# EAGLE design PIPduino (EAGLE 7.1.0)
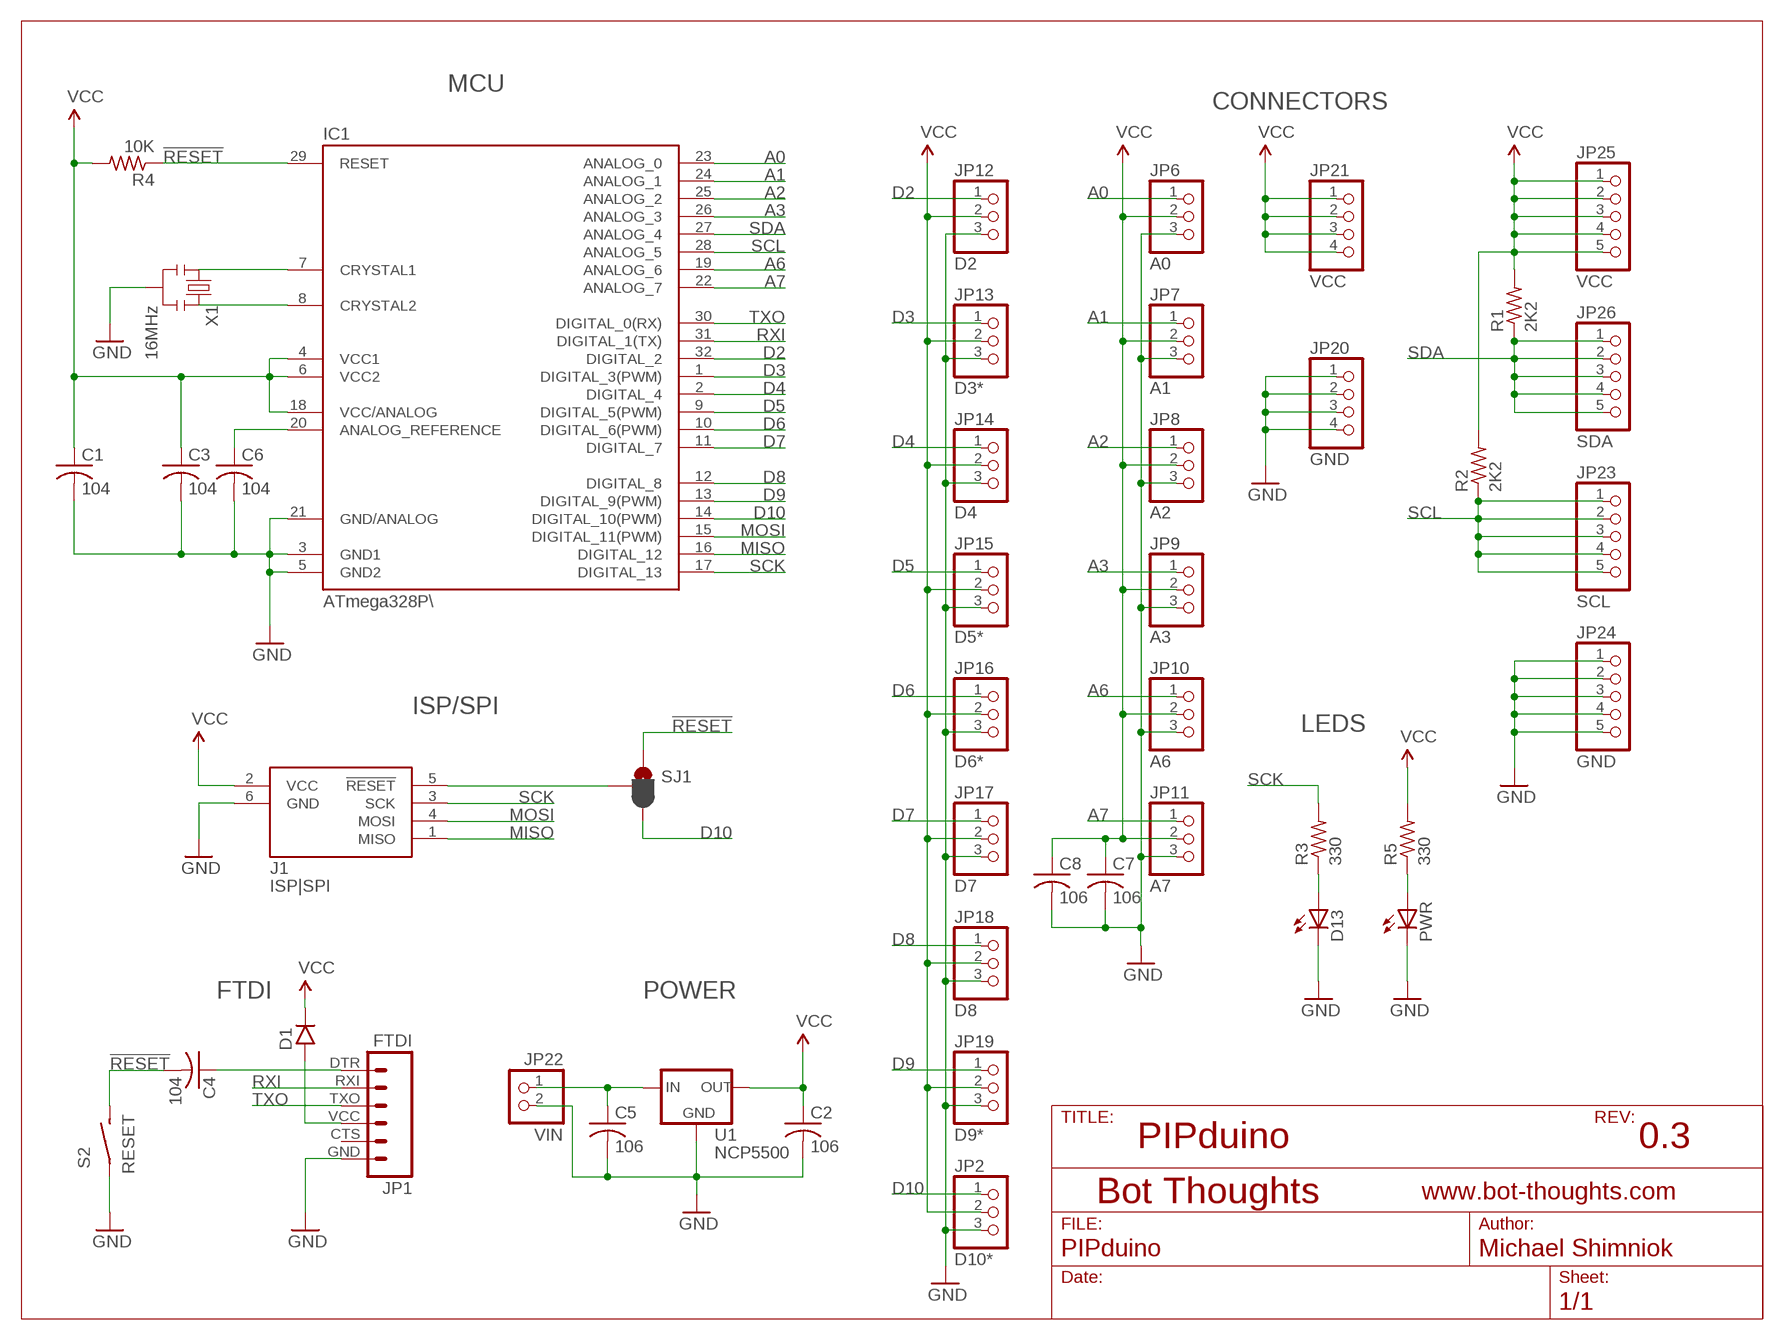
[diagram p0: schematic, sheet 1]

## Parts
C1  104  C-USC0603  [C0603]
C2  106  C-USC1206  [C1206]
C3  104  C-USC0603  [C0603]
C4  104  C-USC0603  [C0603]
C5  106  C-USC1206  [C1206]
C6  104  C-USC0603  [C0603]
C7  106  C-USC1206  [C1206]
C8  106  C-USC1206  [C1206]
D1  DIODE_SOD123FL  [SOD123FL]
D13  LED3MM  [LED3MM]
IC1  ATmega328P\  ATMEGA168-AU  [TQFP32-08]
J1  ISP|SPI  AVRISP6_COMPACT  [CON6P2R]
JP1  FTDI  FTDI_BASICPTH  [FTDI_BASIC]
JP2  D10*  PINHD-1X03_2.54-S  [1X03-S]
JP6  A0  PINHD-1X03_2.54-S  [1X03-S]
JP7  A1  PINHD-1X03_2.54-S  [1X03-S]
JP8  A2  PINHD-1X03_2.54-S  [1X03-S]
JP9  A3  PINHD-1X03_2.54-S  [1X03-S]
JP10  A6  PINHD-1X03_2.54-S  [1X03-S]
JP11  A7  PINHD-1X03_2.54-S  [1X03-S]
JP12  D2  PINHD-1X03_2.54-S  [1X03-S]
JP13  D3*  PINHD-1X03_2.54-S  [1X03-S]
JP14  D4  PINHD-1X03_2.54-S  [1X03-S]
JP15  D5*  PINHD-1X03_2.54-S  [1X03-S]
JP16  D6*  PINHD-1X03_2.54-S  [1X03-S]
JP17  D7  PINHD-1X03_2.54-S  [1X03-S]
JP18  D8  PINHD-1X03_2.54-S  [1X03-S]
JP19  D9*  PINHD-1X03_2.54-S  [1X03-S]
JP20  GND  PINHD-1X04_2.54-S  [1X04-S]
JP21  VCC  PINHD-1X04_2.54-S  [1X04-S]
JP22  VIN  PINHD-1X02_2.54-S  [1X02-S]
JP23  SCL  PINHD-1X05_2.54-S  [1X05-S]
JP24  GND  PINHD-1X05_2.54-S  [1X05-S]
JP25  VCC  PINHD-1X05_2.54-S  [1X05-S]
JP26  SDA  PINHD-1X05_2.54-S  [1X05-S]
PWR  LED3MM  [LED3MM]
R1  2K2  R-US_R0603  [R0603]
R2  2K2  R-US_R0603  [R0603]
R3  330  R-US_R0603  [R0603]
R4  10K  R-US_R0603  [R0603]
R5  330  R-US_R0603  [R0603]
S2  RESET  SPST_3X4X2  [3X4X2TACT]
SJ1  JUMPER-PAD-3-2OF3_NC_BY_PASTE  [PAD-JUMPER-3-2OF3_NC_BY_PASTE_YES_SILK_FULL_BOX]
U1  NCP5500  [DPAK]
X1  16MHz  RESONATOR_CSTCE_V_C  [CSTCE_V_C]

## Nets
!RESET: C4.2 IC1.29(RESET) R4.1 S2.P$2(S) SJ1.1
A0: IC1.23(ANALOG_0) JP6.1
A1: IC1.24(ANALOG_1) JP7.1
A2: IC1.25(ANALOG_2) JP8.1
A3: IC1.26(ANALOG_3) JP9.1
A6: IC1.19(ANALOG_6) JP10.1
A7: IC1.22(ANALOG_7) JP11.1
D2: IC1.32(DIGITAL_2) JP12.1
D3: IC1.1(DIGITAL_3(PWM)) JP13.1
D4: IC1.2(DIGITAL_4) JP14.1
D5: IC1.9(DIGITAL_5(PWM)) JP15.1
D6: IC1.10(DIGITAL_6(PWM)) JP16.1
D7: IC1.11(DIGITAL_7) JP17.1
D8: IC1.12(DIGITAL_8) JP18.1
D9: IC1.13(DIGITAL_9(PWM)) JP19.1
D10: IC1.14(DIGITAL_10(PWM)) JP2.1 SJ1.3
GND: C1.2 C2.2 C3.2 C5.2 C6.2 C7.2 C8.2 D13.K(C) IC1.3(GND1) IC1.5(GND2) IC1.21(GND/ANALOG) J1.6(GND) JP1.GND JP2.3 JP6.3 JP7.3 JP8.3 JP9.3 JP10.3 JP11.3 JP12.3 JP13.3 JP14.3 JP15.3 JP16.3 JP17.3 JP18.3 JP19.3 JP20.1 JP20.2 JP20.3 JP20.4 JP22.2 JP24.1 JP24.2 JP24.3 JP24.4 JP24.5 PWR.K(C) S2.P$1(P) U1.4(GND) X1.GND
MISO: IC1.16(DIGITAL_12) J1.1(MISO)
MOSI: IC1.15(DIGITAL_11(PWM)) J1.4(MOSI)
N$1: D13.A R3.1
N$2: C5.1 JP22.1 U1.1(VIN)
N$3: J1.5(!RESET) SJ1.2
N$4: PWR.A R5.1
N$5: D1.A JP1.VCC
N$6: C6.1 IC1.20(ANALOG_REFERENCE)
N$8: IC1.7(CRYSTAL1) X1.X1
N$13: IC1.8(CRYSTAL2) X1.X2
N$15: C4.1 JP1.DTR
RXI: IC1.31(DIGITAL_1(TX)) JP1.RXI
SCK: IC1.17(DIGITAL_13) J1.3(SCK) R3.2
SCL: IC1.28(ANALOG_5) JP23.1 JP23.2 JP23.3 JP23.4 JP23.5 R2.1
SDA: IC1.27(ANALOG_4) JP26.1 JP26.2 JP26.3 JP26.4 JP26.5 R1.1
TXO: IC1.30(DIGITAL_0(RX)) JP1.TXO
VCC: C1.1 C2.1 C3.1 C7.1 C8.1 D1.C IC1.4(VCC1) IC1.6(VCC2) IC1.18(VCC/ANALOG) J1.2(VCC) JP2.2 JP6.2 JP7.2 JP8.2 JP9.2 JP10.2 JP11.2 JP12.2 JP13.2 JP14.2 JP15.2 JP16.2 JP17.2 JP18.2 JP19.2 JP21.1 JP21.2 JP21.3 JP21.4 JP25.1 JP25.2 JP25.3 JP25.4 JP25.5 R1.2 R2.2 R4.2 R5.2 U1.3(VOUT)
Unconnected: JP1.CTS

## Notes on the sheet
- MCU
- CONNECTORS
- ISP/SPI
- LEDS
- FTDI | POWER
- PIPduino | 0.3

## Library data of the parts
C1-C8 = rcl:C-US: CAPACITOR, American symbol
D1 = bt_diode:DIODE: Diode Collection of generic diodes in various packages
D13 PWR = bt_opto:LED: LED Various packages
IC1 = Arduino-AVR:ATMEGA168
J1 = bt_avr:AVRISP6: 6-pin dual-row connector for Atmel AVRISP programmer interface
JP1 = SparkFun:FTDI_BASIC: FTDI Basic: 3.3V and 5V
JP2 JP6-JP19 = pinhead-2:PINHD-1X03: PIN HEADER
JP20 JP21 = pinhead-2:PINHD-1X04: PIN HEADER
JP22 = pinhead-2:PINHD-1X02: PIN HEADER
JP23-JP26 = pinhead-2:PINHD-1X05: PIN HEADER
R1-R5 = rcl:R-US_: RESISTOR, American symbol
S2 = bt_electromech:SPST: SPST SWITCH
SJ1 = SparkFun-Passives:JUMPER-PAD-3-2OF3_NC_BY_PASTE
U1 = bt_regulator:NCP5500: NCP5500, NCV5500, NCP5501, NCV5501 LDO Voltage Regulator These linear low drop voltage regulators provide up to 500 mA over a user−adjustable output range of 1.25 V to 5.0 V, or at a fixed output voltage of 1.5 V, 3.3 V or 5.0 V, with typical output voltage accuracy better than 3%. Reverse bias protection, thermal shutdown, and short circuit protection. Dropout is 230 mV at 500 mA
X1 = bt_crystal:RESONATOR: Crystal Resonator, 3-pin

## Net classes
1 power: width 0.254 mm

## Board
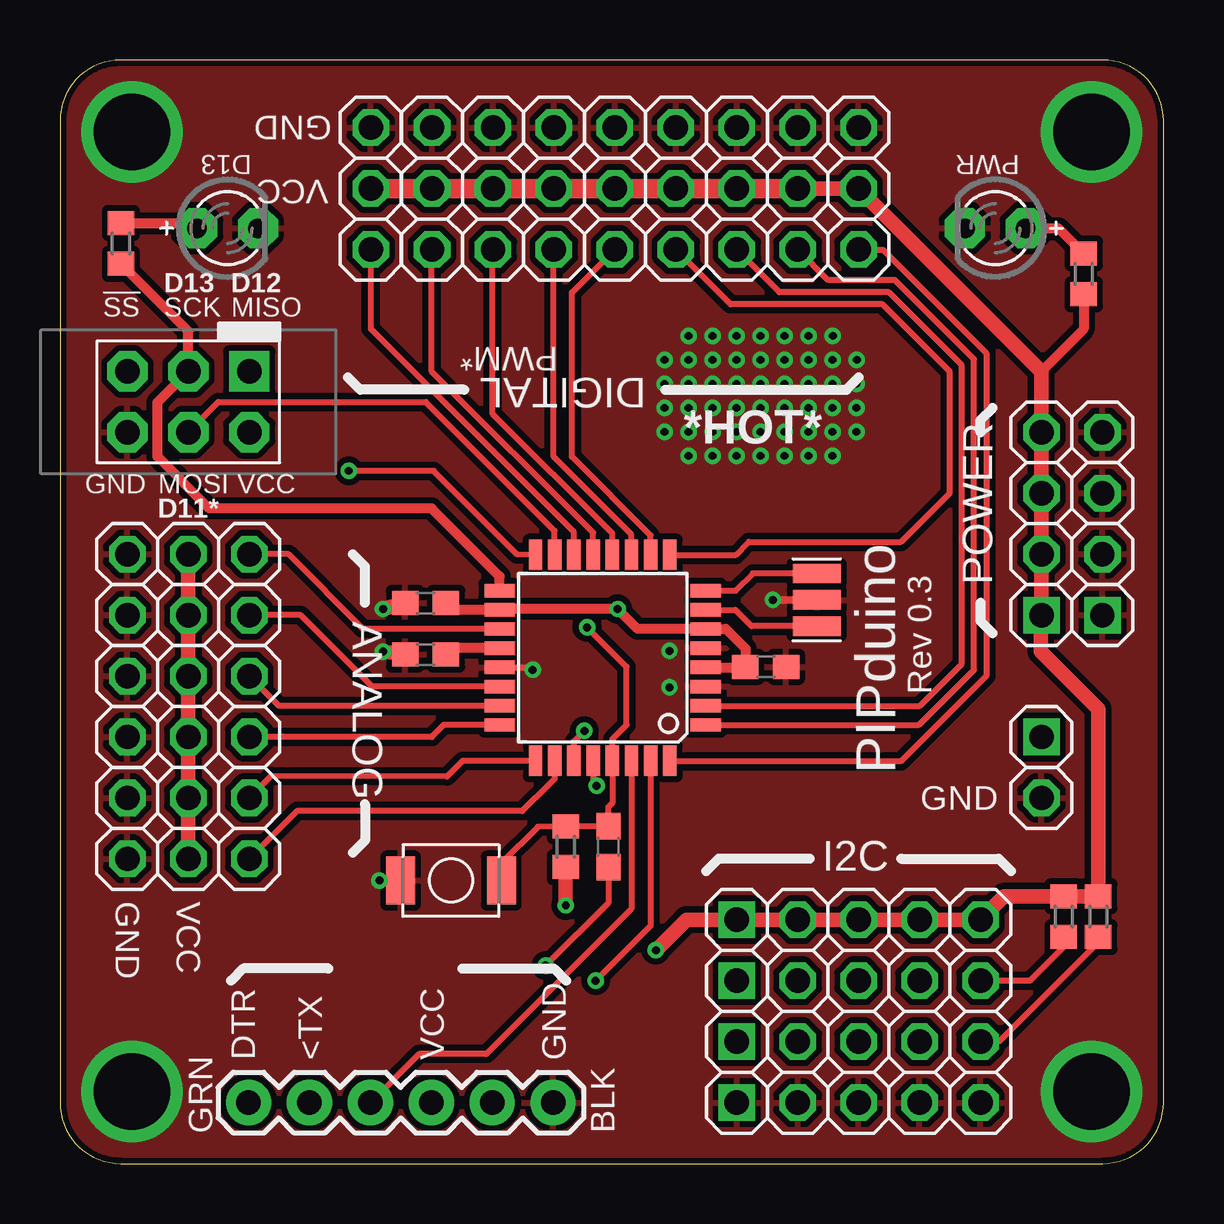
[diagram p1: board, top side]
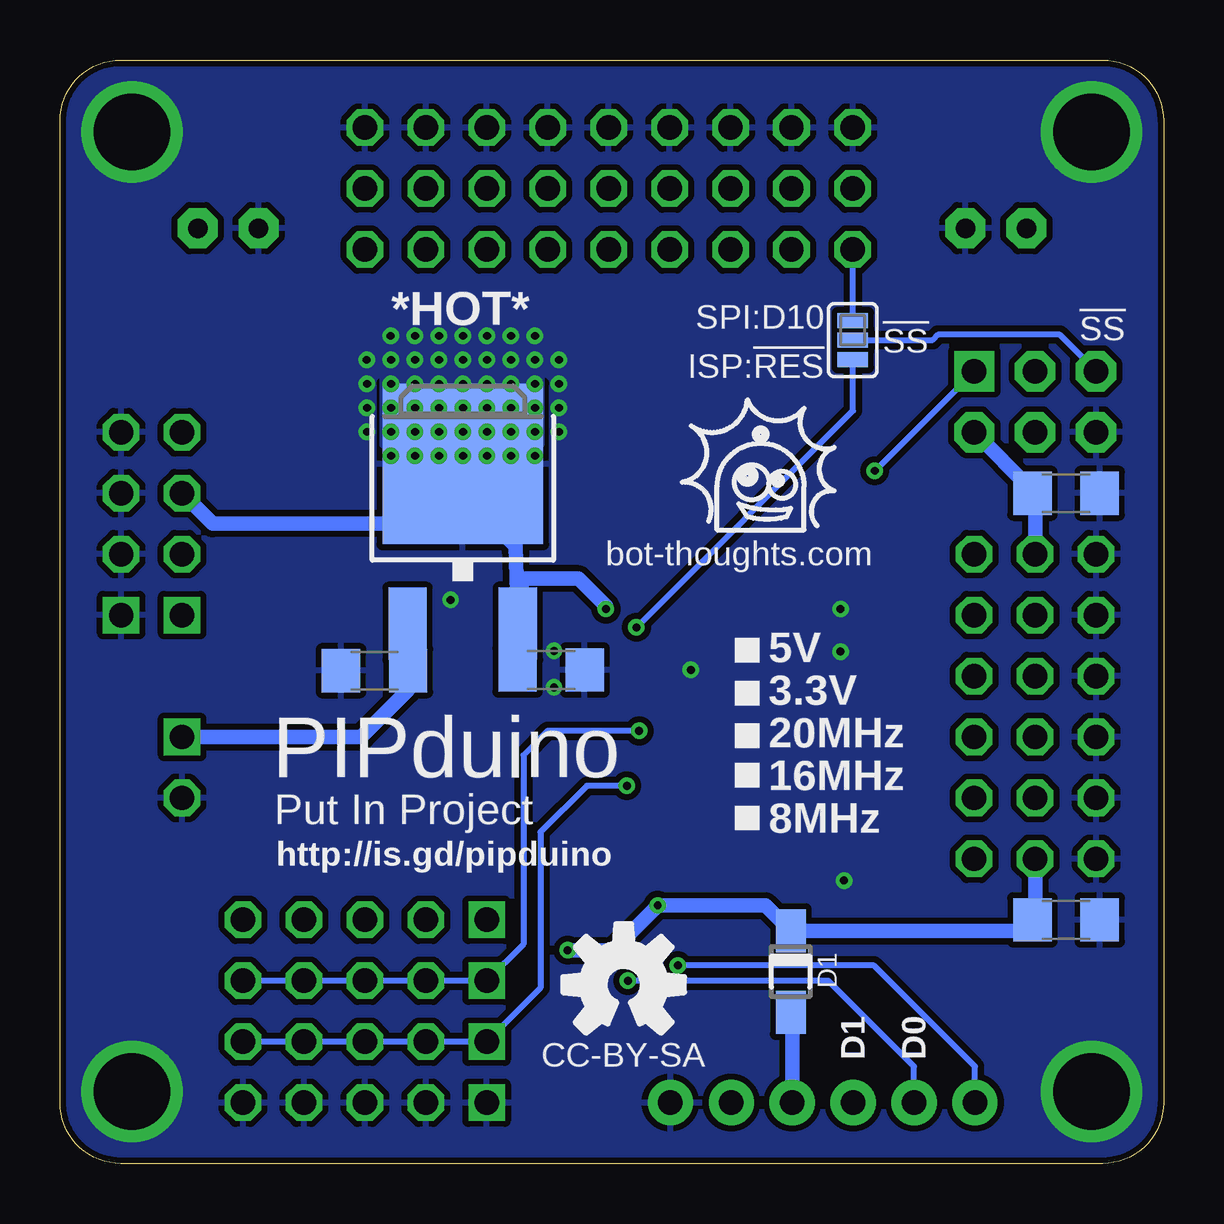
[diagram p2: board, bottom side, seen from below]

Size 46 x 46 mm. Coordinates in mm from the lower left corner, seen from the top.
Outline: 0,43.46 0,2.54 arc90 2.54,0 43.46,0 arc90 46,2.54 46,43.46 arc90 43.46,46 2.54,46 arc90 0,43.46
Copper layers (1*16): Top 0.0356mm / dielectric 1.5011mm / Bottom 0.0356mm
Design rules "LaenPCBOrder *": minimum track width 6mil, minimum drill 13mil, track to track 6mil, track to pad 6mil, pad to pad 6mil, via to via 6mil, smd to smd 6mil, copper to edge 10mil, drill to drill 6mil, minimum pad ring 7mil, minimum via ring 7mil, stop-mask expansion 3mil, vias tented up to drill 20mil, thermal gap 10mil

### Footprints (pad centres in the part's own frame; a part is rotated, then mirrored left to right if it is on the bottom)
C0603 = smd 1.1 x 1: 1 -0.85,0; 2 0.85,0
C1206 = smd 1.6 x 1.8: 1 -1.4,0; 2 1.4,0
SOD123FL = smd 1.8 x 1.25: A 1.7,0; C -1.7,0
LED3MM = drill 0.813 pad 1.676 octagon: A -1.27,0; K 1.27,0
TQFP32-08 = smd 1.27 x 0.559: 1 -4.293,2.8; 2 -4.293,2; 3 -4.293,1.2; 4 -4.293,0.4; 5 -4.293,-0.4; 6 -4.293,-1.2; 7 -4.293,-2; 8 -4.293,-2.8; 17 4.293,-2.8; 18 4.293,-2; 19 4.293,-1.2; 20 4.293,-0.4; 21 4.293,0.4; 22 4.293,1.2; 23 4.293,2; 24 4.293,2.8 | smd 0.559 x 1.27: 9 -2.8,-4.293; 10 -2,-4.293; 11 -1.2,-4.293; 12 -0.4,-4.293; 13 0.4,-4.293; 14 1.2,-4.293; 15 2,-4.293; 16 2.8,-4.293; 25 2.8,4.293; 26 2,4.293; 27 1.2,4.293; 28 0.4,4.293; 29 -0.4,4.293; 30 -1.2,4.293; 31 -2,4.293; 32 -2.8,4.293
CON6P2R = drill 1.016 pad 1.676 square: 1 -2.54,-1.27 | drill 1.016 pad 1.676 octagon: 2 -2.54,1.27; 3 0,-1.27; 4 0,1.27; 5 2.54,-1.27; 6 2.54,1.27
FTDI_BASIC = drill 1.016 pad 1.88: CTS 10.16,0; DTR 0,0; GND 12.7,0; RXI 2.54,0; TXO 5.08,0; VCC 7.62,0
1X03-S = drill 1.016 octagon: 1 -2.54,0; 2 0,0; 3 2.54,0
1X04-S = drill 1.016 square: 1 -3.81,0 | drill 1.016 octagon: 2 -1.27,0; 3 1.27,0; 4 3.81,0
1X02-S = drill 1.016 square: 1 -1.27,0 | drill 1.016 octagon: 2 1.27,0
1X05-S = drill 1.016 square: 1 -5.08,0 | drill 1.016 octagon: 2 -2.54,0; 3 0,0; 4 2.54,0; 5 5.08,0
R0603 = smd 1 x 1.1: 1 -0.85,0; 2 0.85,0
3X4X2TACT = smd 1.2 x 2: P$1 -2.1,0; P$2 2.1,0
PAD-JUMPER-3-2OF3_NC_BY_PASTE_YES_SILK_FULL_BOX = smd 0.635 x 1.27: 1 -0.813,0; 2 0,0; 3 0.813,0
DPAK = smd 1.6 x 3: 1 -2.3,-4.8; 3 2.3,-4.8 | smd 6.7 x 6.7: 4 0,1.86
CSTCE_V_C = smd 0.8 x 2: GND 0,0; X1 -1.1,0; X2 1.1,0

### Placement (x,y rotation side)
C1  15.24,23.37 180 top
C2  25.53,20.57 0 bottom
C3  29.42,20.71 0 top
C4  22.86,13.21 90 top
C5  32.89,20.54 180 bottom
C6  15.24,21.21 180 top
C7  4.06,27.94 0 bottom
C8  4.06,10.16 0 bottom
D1  15.54,8 270 bottom
D13  6.99,38.99 0 top
IC1  22.62,21.08 180 top
J1  5.35,31.75 180 top
JP1  7.86,2.54 0 top
JP2  12.95,40.64 90 top
JP6  5.35,20.32 180 top
JP7  5.35,17.78 180 top
JP8  5.35,15.24 180 top
JP9  5.35,12.7 180 top
JP10  5.35,25.4 180 top
JP11  5.35,22.86 180 top
JP12  33.29,40.64 90 top
JP13  30.75,40.64 90 top
JP14  28.21,40.64 90 top
JP15  25.67,40.64 90 top
JP16  23.13,40.64 90 top
JP17  20.59,40.64 90 top
JP18  18.05,40.64 90 top
JP19  15.51,40.64 90 top
JP20  43.45,26.67 90 top
JP21  40.91,26.67 90 top
JP22  40.91,16.51 270 top
JP23  33.29,5.08 0 top
JP24  33.29,2.54 0 top
JP25  33.29,10.16 0 top
JP26  33.29,7.62 0 top
PWR  38.99,38.99 180 top
R1  41.84,10.29 90 top
R2  43.27,10.29 90 top
R3  2.54,38.35 270 top
R4  21.08,13.21 270 top
R5  42.67,37.08 270 top
S2  16.3,11.8 0 top
SJ1  12.96,34.32 90 bottom
U1  29.21,27.3 0 bottom
X1  31.55,23.5 90 top

### Tracks (layer width: path | path; a pad name or v marks a point on that pad's centre or on a via)
!RESET  (via drill 0.33)
  Top 0.254: v21.97,22.35 23.62,20.7 23.62,18.29 23.02,17.69 IC1.29 23.02,15.02 22.86,14.86 C4.2 R4.1 19.92,14.03 18.41,12.53 18.41,11.81 S2.P$2
  Bottom 0.254: v21.97,22.35 12.94,31.38 12.94,33.42 SJ1.1
A0
  Top 0.254: IC1.23 9.13,19.08 JP6.1
A1
  Top 0.254: IC1.24 16,18.28 15.49,17.78 15.5,17.77 JP7.1
A2
  Top 0.254: IC1.25 16.79,16.79 16.13,16.13 8.8,16.15 JP8.1
A3
  Top 0.254: IC1.26 20.62,16.03 19.83,15.24 19.81,15.24 19.26,14.69 9.88,14.69 JP9.1
A6
  Top 0.254: IC1.19 12.64,22.28 9.53,25.4 JP10.1
A7
  Top 0.254: IC1.22 13.01,19.88 10.03,22.86 JP11.1
D2
  Top 0.254: JP12.1 34.31,38.08 38.61,33.78 38.61,20.32 35.05,16.76 25.45,16.76 IC1.32
D3
  Top 0.254: IC1.1 35.81,18.28 38.1,20.57 38.1,33.53 34.8,36.83 32.02,36.83 JP13.1
D4
  Top 0.254: IC1.2 35.85,19.08 37.59,20.83 37.59,33.27 34.54,36.32 29.99,36.32 JP14.1
D5
  Top 0.254: JP15.1 27.96,35.81 34.29,35.81 37.08,33.02 37.08,27.94 35.05,25.91 28.7,25.91 28.17,25.38 IC1.9
D6
  Top 0.254: IC1.10 24.62,26.18 21.34,29.46 21.34,36.31 JP16.1
D7
  Top 0.254: IC1.11 23.82,26.22 20.57,29.46 20.57,38.08 JP17.1
D8
  Top 0.254: IC1.12 23.02,26.25 18.03,31.24 18.03,38.08 JP18.1
D9
  Top 0.254: IC1.13 22.22,26.29 15.49,33.02 15.49,38.08 JP19.1
D10
  Top 0.254: JP2.1 12.95,34.8 21.42,26.33 IC1.14
  Bottom 0.254: SJ1.3 12.96,37 JP2.1
GND  (via drill 0.33, 3.2)
  Top 0.254: IC1.21 19.59,20.68 v19.7,20.57 | S2.P$1 14.22,12.19 14.11,11.8 v13.32,11.8
  Top 0.305: X1.GND v29.72,23.5
  Top 0.61: C3.2 30.19,20.71 | C6.2 v13.46,21.34 | C1.2 v13.46,23.11
  other vias: 3,3 3,43 43,43 43,3 27.2,34.5 28.2,34.5 28.2,33.5 27.2,33.5 29.2,34.5 30.2,34.5 31.2,34.5 31.2,33.5 31.2,32.5 30.2,32.5 29.2,32.5 29.2,33.5 30.2,33.5 31.2,31.5 30.2,31.5 29.2,31.5 27.2,30.5 28.2,30.5 29.2,30.5 30.2,30.5 31.2,30.5 27.2,29.5 28.2,29.5 29.2,29.5 30.2,29.5 31.2,29.5 32.2,29.5 32.2,30.5 32.2,31.5 32.2,32.5 32.2,33.5 33.2,31.5 33.2,30.5 33.2,32.5 26.2,29.5 26.2,30.5 26.2,33.5 26.2,34.5 25.2,30.5 25.2,33.5 25.2,32.5 26.2,32.5 27.2,32.5 28.2,32.5 28.2,31.5 27.2,31.5 26.2,31.5 25.2,31.5 32.22,34.5 33.22,33.5 25.41,19.85 25.41,21.37
  pour Bottom (isolate 0.254, rank 3): 0,43.46 0,2.54 arc90 2.54,0 43.46,0 arc90 46,2.54 46,43.46 arc90 43.46,46 2.54,46 arc90
  pour Top (isolate 0.254, rank 3): 0.1,43.46 0.1,2.54 arc90 2.64,0 43.56,0 arc90 46.1,2.54 46.1,43.46 arc90 43.56,46 2.64,46 arc90
  pour Bottom (no thermals): 26,36 32.5,36 32.5,30 26,30
MISO  (via drill 0.33)
  Top 0.254: IC1.16 19.06,25.39 15.57,28.88 v12.04,28.88
  Bottom 0.254: v12.04,28.88 J1.1
MOSI
  Top 0.254: J1.4 5.35,30.5 6.6,31.75 15.24,31.75 20.62,26.37 IC1.15
N$1
  Top 0.406: R3.1 5.5,39.2 D13.A
N$2
  Bottom 0.61: JP22.1 33.44,17.78 31.49,19.73 C5.1 31.47,21.58 U1.1
N$3
  Bottom 0.254: J1.5 arc-45 2.82,33.05 4.32,34.54 9.4,34.54 9.62,34.32 SJ1.2
N$4
  Top 0.406: PWR.A 41.62,38.99 R5.1
N$5
  Bottom 0.61: D1.A 15.48,6.3 JP1.VCC
N$6
  Top 0.406: 16.15,21.48 16,21.34 C6.1 16.24,21.48 IC1.20
N$8
  Top 0.254: IC1.7 28.15,23.08 28.83,22.4 X1.X1
N$13
  Top 0.254: IC1.8 28.16,23.88 28.88,24.6 X1.X2
N$15  (via drill 0.33)
  Top 0.254: v20.25,8.26 22.86,10.87 C4.1 22.61,12.39
  Bottom 0.254: JP1.DTR 7.86,4.05 12.06,8.26 v20.25,8.26
RXI  (via drill 0.33)
  Top 0.254: IC1.31 24.62,9.91 v22.33,7.62
  Bottom 0.254: JP1.RXI 10.4,4.05 13.97,7.62 v22.33,7.62
SCK
  Top 0.406: IC1.17 18.33,24.47 15.49,27.3 6.22,27.3 4.06,29.46 4.06,31.73 J1.3 5.35,34.69 R3.2
SCL  (via drill 0.33)
  Top 0.254: IC1.28 22.22,15.86 v22.37,15.75 | R2.1 43.27,9.22 39.13,5.08 JP23.5
  Bottom 0.254: v22.37,15.75 24.04,15.75 25.97,13.82 25.97,7.32 JP23.1 JP23.2 JP23.3 JP23.4 JP23.5
SDA  (via drill 0.33)
  Top 0.254: IC1.27 21.42,17.6 v21.86,18.03 | R1.1 41.84,9.02 40.44,7.62 JP26.5
  Bottom 0.254: v21.86,18.03 25.67,18.03 26.69,17.02 26.69,9.14 JP26.1 JP26.2 JP26.3 JP26.4 JP26.5
TXO
  Top 0.254: IC1.30 23.82,10.61 17.78,4.57 14.97,4.57 JP1.TXO
VCC  (via drill 0.33)
  Top 0.406: 18.19,23.08 16.12,23.08 C1.1 | IC1.4 28.54,20.68 C3.1 28.57,21.46 27.76,22.28 IC1.6 24.07,22.28 v23.24,23.11 18.67,23.11 18.19,23.08 | 18.19,23.08 IC1.18 | R5.2 42.67,34.78 40.91,33.02
  Top 0.61: JP10.2 JP11.2 JP6.2 JP7.2 JP8.2 JP9.2 | v24.84,8.89 26.11,10.16 JP25.1 JP25.2 JP25.3 JP25.4 JP25.5 39.35,11.14 R1.2 R2.2 43.27,18.96 40.89,21.34 40.89,22.84 JP21.1 JP21.2 JP21.3 JP21.4 40.91,33.02 JP12.2 30.23,40.64 | R4.2 v21.08,10.76
  Top 0.813: JP2.2 JP19.2 JP18.2 JP17.2 JP16.2 JP15.2 JP14.2 30.23,40.64 JP13.2
  Bottom 0.406: 5.35,27.83 C7.1 | 5.35,10.27 C8.1
  Bottom 0.61: 5.35,10.27 JP9.2 | 5.35,27.83 JP10.2 | v24.84,8.89 22.95,8.89 v21.08,10.76 16.6,10.76 D1.C 5.92,9.7 C8.1 | U1.3 27,21.66 C2.1 | v23.24,23.11 23.24,23.24 24.38,24.38 26.72,24.38 U1.3 | U1.3 27,25.73 27.94,26.67 39.64,26.67 JP21.3 | C7.1 5.46,28.05 J1.2

### Text on the board
tNames: GND | VCC | D13 | D12 | !SS | SCK | MISO | PWM* | DIGITAL | *HOT* | GND | MOSI | VCC | D11* | POWER | ANALOG | Rev 0.3 | PIPduino | GND | I2C | GND | VCC | DTR | <TX | VCC | GND | GRN | BLK
bNames: SPI:D10 | *HOT* | !SS | !SS | ISP:!RES | bot-thoughts.com | 5V | 3.3V | 20MHz | 16MHz | PIPduino | 8MHz | Put In Project | http://is.gd/pipduino | D0 | D1 | CC-BY-SA
bValues: Holes on 40mm square | #4/M3
tsilk: GND | D13 | PWR | VCC | + | + | 330 | 330 | D13 | D12 | D10* | D9* | D8 | D7 | D6* | D5* | D4 | D3* | D2 | !SS | SCK | MISO | ISP|SPI | PWM* | DIGITAL | VCC | GND | *HOT* | GND | MOSI | VCC | D11* | ATmega328P\ | A6 | 104 | POWER | ANALOG | A7 | A0 | 104 | 104 | Rev 0.3 | VIN | A1 | PIPduino | GND | A2 | RESET | 104 | A3 | 10K | I2C | GND | VCC | VCC | 2K2 | 2K2 | SDA | FTDI | SCL | DTR | D0 | RXI | D1 | TXO | VCC | GND | GND | GRN | BLK
bsilk: Holes on 40cm square | #4/M3 | SPI:D9 | *HOT* | !SS | !SS | ISP:!RES | NCP5500 | 106 | bot-thoughts.com | 5V | 106 | 106 | 3.3V | 20MHz | 16MHz | PIPduino | 8MHz | Put In Project | http://is.gd/pipduino | 106 | D1 | CC-BY-SA